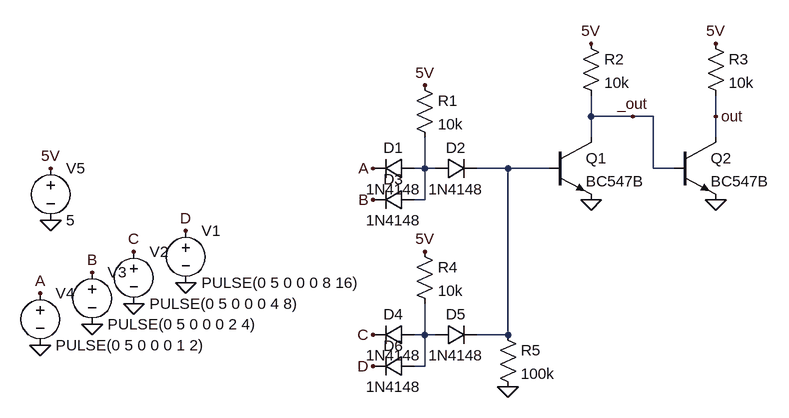
[diagram p0: schematic and_or.asc]
and_or.asc, the LTspice schematic file:
Version 4
SHEET 1 880 680
WIRE 448 0 448 -32
WIRE 512 0 448 0
WIRE 544 0 512 0
WIRE 640 0 640 -32
WIRE 448 32 448 0
WIRE 640 32 640 0
WIRE 192 80 192 32
WIRE 192 80 176 80
WIRE 208 80 192 80
WIRE 320 80 272 80
WIRE 384 80 320 80
WIRE 544 80 544 0
WIRE 576 80 544 80
WIRE 192 128 192 80
WIRE 192 128 176 128
WIRE 192 336 192 288
WIRE 192 336 176 336
WIRE 208 336 192 336
WIRE 320 336 320 80
WIRE 320 336 272 336
WIRE 192 384 192 336
WIRE 192 384 176 384
FLAG -176 256 0
FLAG -176 176 D
FLAG 112 80 A
FLAG 192 -48 5V
FLAG 448 128 0
FLAG 448 -112 5V
FLAG 640 128 0
FLAG 640 -112 5V
FLAG 640 0 out
FLAG 512 0 _out
FLAG 112 128 B
FLAG 112 336 C
FLAG 192 208 5V
FLAG 112 384 D
FLAG 320 416 0
FLAG -256 288 0
FLAG -256 208 C
FLAG -320 320 0
FLAG -320 240 B
FLAG -400 352 0
FLAG -400 272 A
FLAG -384 160 0
FLAG -384 80 5V
SYMBOL voltage -176 160 R0
SYMATTR InstName V1
SYMATTR Value PULSE(0 5 0 0 0 8 16)
SYMBOL diode 176 64 R90
WINDOW 0 0 32 VBottom 2
WINDOW 3 32 32 VTop 2
SYMATTR InstName D1
SYMATTR Value 1N4148
SYMBOL res 176 -64 R0
SYMATTR InstName R1
SYMATTR Value 10k
SYMBOL diode 208 96 R270
WINDOW 0 32 32 VTop 2
WINDOW 3 0 32 VBottom 2
SYMATTR InstName D2
SYMATTR Value 1N4148
SYMBOL npn 384 32 R0
SYMATTR InstName Q1
SYMATTR Value BC547B
SYMBOL res 432 -128 R0
SYMATTR InstName R2
SYMATTR Value 10k
SYMBOL npn 576 32 R0
SYMATTR InstName Q2
SYMATTR Value BC547B
SYMBOL res 624 -128 R0
SYMATTR InstName R3
SYMATTR Value 10k
SYMBOL diode 176 112 R90
WINDOW 0 0 32 VBottom 2
WINDOW 3 32 32 VTop 2
SYMATTR InstName D3
SYMATTR Value 1N4148
SYMBOL diode 176 320 R90
WINDOW 0 0 32 VBottom 2
WINDOW 3 32 32 VTop 2
SYMATTR InstName D4
SYMATTR Value 1N4148
SYMBOL res 176 192 R0
SYMATTR InstName R4
SYMATTR Value 10k
SYMBOL diode 208 352 R270
WINDOW 0 32 32 VTop 2
WINDOW 3 0 32 VBottom 2
SYMATTR InstName D5
SYMATTR Value 1N4148
SYMBOL diode 176 368 R90
WINDOW 0 0 32 VBottom 2
WINDOW 3 32 32 VTop 2
SYMATTR InstName D6
SYMATTR Value 1N4148
SYMBOL res 304 320 R0
SYMATTR InstName R5
SYMATTR Value 100k
SYMBOL voltage -256 192 R0
SYMATTR InstName V2
SYMATTR Value PULSE(0 5 0 0 0 4 8)
SYMBOL voltage -320 224 R0
SYMATTR InstName V3
SYMATTR Value PULSE(0 5 0 0 0 2 4)
SYMBOL voltage -400 256 R0
WINDOW 123 0 0 Left 0
WINDOW 39 0 0 Left 0
SYMATTR InstName V4
SYMATTR Value PULSE(0 5 0 0 0 1 2)
SYMBOL voltage -384 64 R0
SYMATTR InstName V5
SYMATTR Value 5

The netlist it stands for:
* and_or.asc
V1 D 0 PULSE(0 5 0 0 0 8 16)
D1 N001 A 1N4148
R1 5V N001 10k
D2 N001 N002 1N4148
Q1 _out N002 0 0 BC547B
R2 5V _out 10k
Q2 out _out 0 0 BC547B
R3 5V out 10k
D3 N001 B 1N4148
D4 N003 C 1N4148
R4 5V N003 10k
D5 N003 N002 1N4148
D6 N003 D 1N4148
R5 N002 0 100k
V2 C 0 PULSE(0 5 0 0 0 4 8)
V3 B 0 PULSE(0 5 0 0 0 2 4)
V4 A 0 PULSE(0 5 0 0 0 1 2)
V5 5V 0 5
.model D D
.lib standard.dio
.model NPN NPN
.model PNP PNP
.lib standard.bjt
.backanno
.end